# Altium project CSR8311_Core.PrjPcb
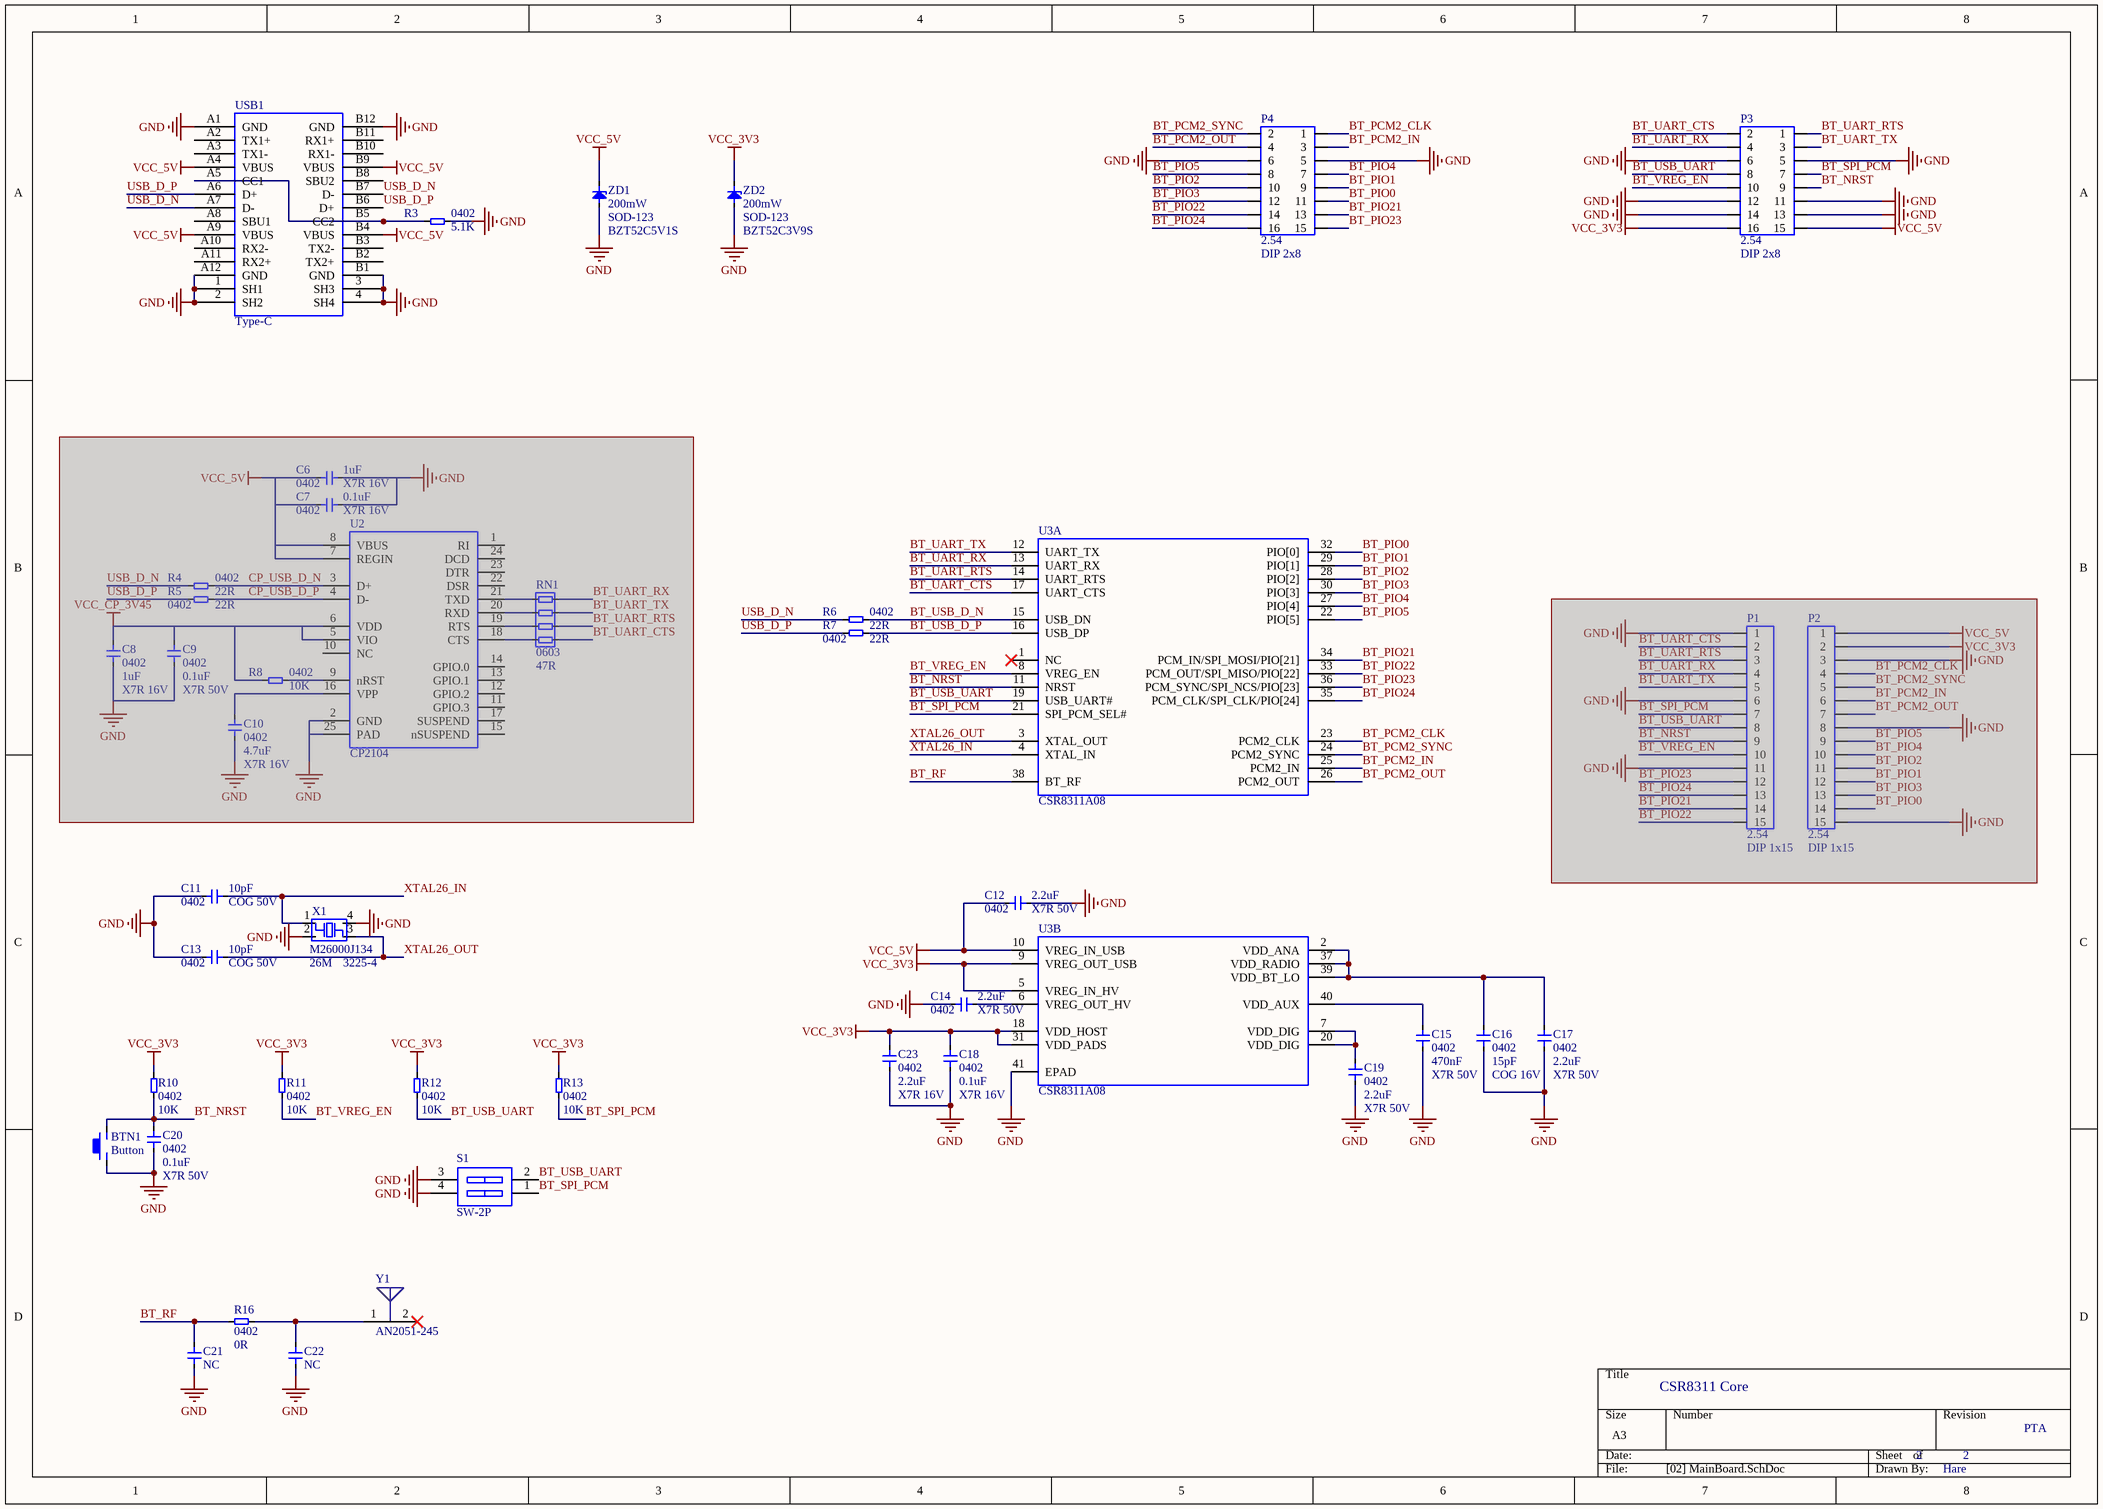
[diagram p0: [02] MainBoard.SchDoc]
1 sheet, 43 parts. Net scope: global (net labels, ports and power ports of the same name join across sheets).
Board file: CSR8311_Core.PcbDoc

## Sheet [02] MainBoard.SchDoc
size A3

### Parts
BTN1  Button  [BTN-4P-4.2*3.4*2.5]
C6  Footprint: 0402  Specification: X7R 16V  [CAP_0402]  (hidden comment: 1uF)  (masked out: inside a compile mask, not in the netlist)
C7  Footprint: 0402  Specification: X7R 16V  [CAP_0402]  (hidden comment: 0.1uF)  (masked out: inside a compile mask, not in the netlist)
C8  Footprint: 0402  Specification: X7R 16V  [CAP_0402]  (hidden comment: 1uF)  (masked out: inside a compile mask, not in the netlist)
C9  Footprint: 0402  Specification: X7R 50V  [CAP_0402]  (hidden comment: 0.1uF)  (masked out: inside a compile mask, not in the netlist)
C10  Footprint: 0402  Specification: X7R 16V  [CAP_0402]  (hidden comment: 4.7uF)  (masked out: inside a compile mask, not in the netlist)
C11  Footprint: 0402  Specification: COG 50V  [CAP_0402]  (hidden comment: 10pF)
C12  Footprint: 0402  Specification: X7R 50V  [CAP_0402]  (hidden comment: 2.2uF)
C13  Footprint: 0402  Specification: COG 50V  [CAP_0402]  (hidden comment: 10pF)
C14  Footprint: 0402  Specification: X7R 50V  [CAP_0402]  (hidden comment: 2.2uF)
C15  Footprint: 0402  Specification: X7R 50V  [CAP_0402]  (hidden comment: 470nF)
C16  Footprint: 0402  Specification: COG 16V  [CAP_0402]  (hidden comment: 15pF)
C17  Footprint: 0402  Specification: X7R 50V  [CAP_0402]  (hidden comment: 2.2uF)
C18  Footprint: 0402  Specification: X7R 16V  [CAP_0402]  (hidden comment: 0.1uF)
C19  Footprint: 0402  Specification: X7R 50V  [CAP_0402]  (hidden comment: 2.2uF)
C20  Footprint: 0402  Specification: X7R 50V  [CAP_0402]  (hidden comment: 0.1uF)
C21  NC  [CAP_0402]
C22  NC  [CAP_0402]
C23  Footprint: 0402  Specification: X7R 16V  [CAP_0402]  (hidden comment: 2.2uF)
P1  Type: 2.54  [HDR1X15_2.54_180]  (hidden comment: DIP 1x15)  (masked out: inside a compile mask, not in the netlist)
P2  Type: 2.54  [HDR1X15_2.54_180]  (hidden comment: DIP 1x15)  (masked out: inside a compile mask, not in the netlist)
P3  Type: 2.54  [HDR2X8_2.54_180]  (hidden comment: DIP 2x8)
P4  Type: 2.54  [HDR2X8_2.54_180]  (hidden comment: DIP 2x8)
R3  Footprint: 0402  [RES_0402]  (hidden comment: 5.1K)
R4  Footprint: 0402  [RES_0402]  (hidden comment: 22R)  (masked out: inside a compile mask, not in the netlist)
R5  Footprint: 0402  [RES_0402]  (hidden comment: 22R)  (masked out: inside a compile mask, not in the netlist)
R6  Footprint: 0402  [RES_0402]  (hidden comment: 22R)
R7  Footprint: 0402  [RES_0402]  (hidden comment: 22R)
R8  Footprint: 0402  [RES_0402]  (hidden comment: 10K)  (masked out: inside a compile mask, not in the netlist)
R10  Footprint: 0402  [RES_0402]  (hidden comment: 10K)
R11  Footprint: 0402  [RES_0402]  (hidden comment: 10K)
R12  Footprint: 0402  [RES_0402]  (hidden comment: 10K)
R13  Footprint: 0402  [RES_0402]  (hidden comment: 10K)
R16  Footprint: 0402  [RES_0402]  (hidden comment: 0R)
RN1  Footprint: 0603  [RES_0402X4]  (hidden comment: 47R)  (masked out: inside a compile mask, not in the netlist)
S1  SW-2P  [SW-SMD-2-1.27]
U2  CP2104  [QFN-24-4.0X4.0-P0.5]  (masked out: inside a compile mask, not in the netlist)
U3  CSR8311A08  [QFN-40-P0.5]  (parts A,B of 2)
USB1  Type-C  [USB-Type-C]
X1  Specification: 26M  Footprint: 3225-4  [XTAL_3225-4]  (hidden comment: M26000J134)
Y1  AN2051-245  [ANT_2.4G_5.1X2.0]
ZD1  Specification: 200mW  [SOD-123]  (hidden comment: BZT52C5V1S)
ZD2  Specification: 200mW  [SOD-123]  (hidden comment: BZT52C3V9S)

### Nets
GND: BTN1.1 C11.1 C12.2 C13.1 C14.1 C15.2 C16.2 C17.2 C18.1 C19.2 C20.2 C21.1 C22.1 C23.2 P3.5 P3.6 P3.11 P3.12 P3.13 P3.14 P4.5 P4.6 R3.1 S1.3(B2) S1.4(B1) U3.41(EPAD) USB1.1(SH1) USB1.2(SH2) USB1.3(SH3) USB1.4(SH4) USB1.A1(GND) USB1.A12(GND) USB1.B1(GND) USB1.B12(GND) X1.2(GND) X1.4(GND) ZD1.1 ZD2.1
VCC_3V3: C18.2 C23.1 P3.16 R10.1 R11.1 R12.1 R13.1 U3.5(VREG_IN_HV) U3.9(VREG_OUT_USB) U3.18(VDD_HOST) U3.31(VDD_PADS) ZD2.2
VCC_5V: C12.1 P3.15 U3.10(VREG_IN_USB) USB1.A4(VBUS) USB1.A9(VBUS) USB1.B4(VBUS) USB1.B9(VBUS) ZD1.2
BT_NRST: BTN1.2 C20.1 P3.9 R10.2 U3.11(NRST)
BT_PCM2_CLK: P4.1 U3.23(PCM2_CLK)
BT_PCM2_IN: P4.3 U3.25(PCM2_IN)
BT_PCM2_OUT: P4.4 U3.26(PCM2_OUT)
BT_PCM2_SYNC: P4.2 U3.24(PCM2_SYNC)
BT_PIO0: P4.11 U3.32(PIO[0])
BT_PIO1: P4.9 U3.29(PIO[1])
BT_PIO2: P4.10 U3.28(PIO[2])
BT_PIO3: P4.12 U3.30(PIO[3])
BT_PIO4: P4.7 U3.27(PIO[4])
BT_PIO5: P4.8 U3.22(PIO[5])
BT_PIO21: P4.13 U3.34(PCM_IN/SPI_MOSI/PIO[21])
BT_PIO22: P4.14 U3.33(PCM_OUT/SPI_MISO/PIO[22])
BT_PIO23: P4.15 U3.36(PCM_SYNC/SPI_NCS/PIO[23])
BT_PIO24: P4.16 U3.35(PCM_CLK/SPI_CLK/PIO[24])
BT_RF: C21.2 R16.1 U3.38(BT_RF)
BT_SPI_PCM: P3.7 R13.2 S1.1(A1) U3.21(SPI_PCM_SEL#)
BT_UART_CTS: P3.2 U3.17(UART_CTS)
BT_UART_RTS: P3.1 U3.14(UART_RTS)
BT_UART_RX: P3.4 U3.13(UART_RX)
BT_UART_TX: P3.3 U3.12(UART_TX)
BT_USB_D_N: R6.1 U3.15(USB_DN)
BT_USB_D_P: R7.1 U3.16(USB_DP)
BT_USB_UART: P3.8 R12.2 S1.2(A2) U3.19(USB_UART#)
BT_VREG_EN: P3.10 R11.2 U3.8(VREG_EN)
USB_D_N: R6.2 USB1.A7(D-) USB1.B7(D-)
USB_D_P: R7.2 USB1.A6(D+) USB1.B6(D+)
XTAL26_IN: C11.2 U3.4(XTAL_IN) X1.1(IN)
XTAL26_OUT: C13.2 U3.3(XTAL_OUT) X1.3(OUT)
NetC14_2: C14.2 U3.6(VREG_OUT_HV)
NetC15_1: C15.1 U3.40(VDD_AUX)
NetC16_1: C16.1 C17.1 U3.2(VDD_ANA) U3.37(VDD_RADIO) U3.39(VDD_BT_LO)
NetC19_1: C19.1 U3.7(VDD_DIG) U3.20(VDD_DIG)
NetC22_2: C22.2 R16.2 Y1.1(FP)
NetR3_2: R3.2 USB1.A5(CC1) USB1.B5(CC2)

Not connected (* = marked no-connect by the designer): U3 1(NC)*; USB1 A2(TX1+) A3(TX1-) A8(SBU1) A10(RX2-) A11(RX2+) B2(TX2+) B3(TX2-) B8(SBU2) B10(RX1-) B11(RX1+); Y1 2(NC)*

### Notes on the sheet
- CSR8311 Core
- 2
- PTA
- Hare
- Title
- Size:
- Date:
- A4
- Number:
- Time:
- Revision:
- Sheet
- of
- File:

### Library data of the parts
C6-C20 C23 = CAP: Capacitor; Manufacturer: *
  C6 C8: Value: 1uF
  C7 C9 C18 C20: Value: 0.1uF
  C10: Value: 4.7uF
  C11 C13: Value: 10pF
  C12 C14 C17 C19 C23: Value: 2.2uF
  C15: Value: 470nF
  C16: Value: 15pF
C21 C22 = CAP: Capacitor; Specification: X7R 16V; Manufacturer: *; Footprint: 0402; Value: NC
P1 P2 = HDR1x15: Header; Value: DIP 1x15
P3 P4 = HDR2x8: Header; Value: DIP 2x8
R3-R8 R10-R13 R16 = RES: Resistor; Specification: ±1%; Manufacturer: *
  R3: Value: 5.1K
  R4-R7: Value: 22R
  R8 R10-R13: Value: 10K
  R16: Value: 0R
RN1 = RES-4: Resistor Array; Specification: ±5%; Value: 47R
S1 = SW-2P: 拨码开关2P
U2 = CP2104: SINGLE-CHIP USB-TO-UART BRIDGE
U3 = CSR8311: Bluetooth v4.1 single-chip radio and baseband IC for automotive applications.
USB1 = USB-Type-C
X1 = XTAL-4P: Value: M26000J134
Y1 = ANTENNA
ZD1 ZD2 = Diode-ZD: Zender Diode; Manufacturer: *
  ZD1: Value: BZT52C5V1S
  ZD2: Value: BZT52C3V9S